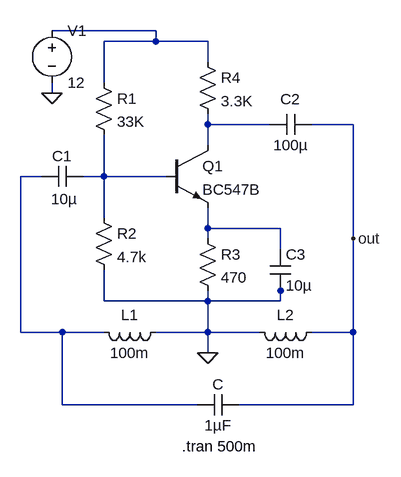
[diagram p0: schematic Circuit.asc]
Circuit.asc, the LTspice schematic file:
Version 4
SHEET 1 984 680
WIRE 368 -128 208 -128
WIRE 368 -112 368 -128
WIRE 368 -112 288 -112
WIRE 448 -112 368 -112
WIRE 448 -80 448 -112
WIRE 288 -48 288 -112
WIRE 208 -32 208 -48
WIRE 448 16 448 0
WIRE 544 16 448 16
WIRE 672 16 608 16
WIRE 448 48 448 16
WIRE 192 96 160 96
WIRE 288 96 288 32
WIRE 288 96 256 96
WIRE 384 96 288 96
WIRE 288 160 288 96
WIRE 448 176 448 144
WIRE 560 176 448 176
WIRE 448 192 448 176
WIRE 672 192 672 16
WIRE 560 208 560 176
WIRE 560 272 560 256
WIRE 288 288 288 240
WIRE 448 288 448 272
WIRE 448 288 288 288
WIRE 560 288 560 272
WIRE 560 288 448 288
WIRE 160 336 160 96
WIRE 224 336 160 336
WIRE 288 336 224 336
WIRE 448 336 448 288
WIRE 448 336 368 336
WIRE 528 336 448 336
WIRE 672 336 672 192
WIRE 672 336 608 336
WIRE 448 368 448 336
WIRE 224 448 224 336
WIRE 432 448 224 448
WIRE 672 448 672 336
WIRE 672 448 496 448
FLAG 208 -32 0
FLAG 448 368 0
FLAG 672 192 out
SYMBOL cap 256 80 R90
WINDOW 0 0 32 VBottom 2
WINDOW 3 35 29 VTop 2
SYMATTR InstName C1
SYMATTR Value 10µ
SYMBOL res 272 -64 R0
SYMATTR InstName R1
SYMATTR Value 33K
SYMBOL res 272 144 R0
SYMATTR InstName R2
SYMATTR Value 4.7k
SYMBOL res 432 176 R0
SYMATTR InstName R3
SYMATTR Value 470
SYMBOL npn 384 48 R0
SYMATTR InstName Q1
SYMATTR Value BC547B
SYMBOL cap 544 32 R270
WINDOW 0 39 31 VTop 2
WINDOW 3 0 32 VBottom 2
SYMATTR InstName C2
SYMATTR Value 100µ
SYMBOL cap 544 208 R0
SYMATTR InstName C3
SYMATTR Value 10µ
SYMBOL ind 624 320 R90
WINDOW 0 5 56 VBottom 2
WINDOW 3 32 56 VTop 2
SYMATTR InstName L2
SYMATTR Value 100m
SYMBOL cap 496 432 R90
WINDOW 0 0 32 VBottom 2
WINDOW 3 32 32 VTop 2
SYMATTR InstName C
SYMATTR Value 1µF
SYMBOL voltage 208 -144 R0
WINDOW 123 0 0 Left 0
WINDOW 39 0 0 Left 0
SYMATTR InstName V1
SYMATTR Value 12
SYMBOL ind 384 320 R90
WINDOW 0 5 56 VBottom 2
WINDOW 3 32 56 VTop 2
SYMATTR InstName L1
SYMATTR Value 100m
SYMBOL res 432 -96 R0
SYMATTR InstName R4
SYMATTR Value 3.3K
TEXT 408 512 Left 2 !.tran 500m

The netlist it stands for:
* Circuit.asc
C1 N004 N003 10µ
R1 N001 N004 33K
R2 N004 0 4.7k
R3 N005 0 470
Q1 N002 N004 N005 0 BC547B
C2 N002 out 100µ
C3 N005 0 10µ
L2 out 0 100m
C out N003 1µF
V1 N001 0 12
L1 0 N003 100m
R4 N001 N002 3.3K
.model NPN NPN
.model PNP PNP
.lib standard.bjt
.tran 500m
.backanno
.end